# EAGLE design sim7000 gps (EAGLE 9.5.2)
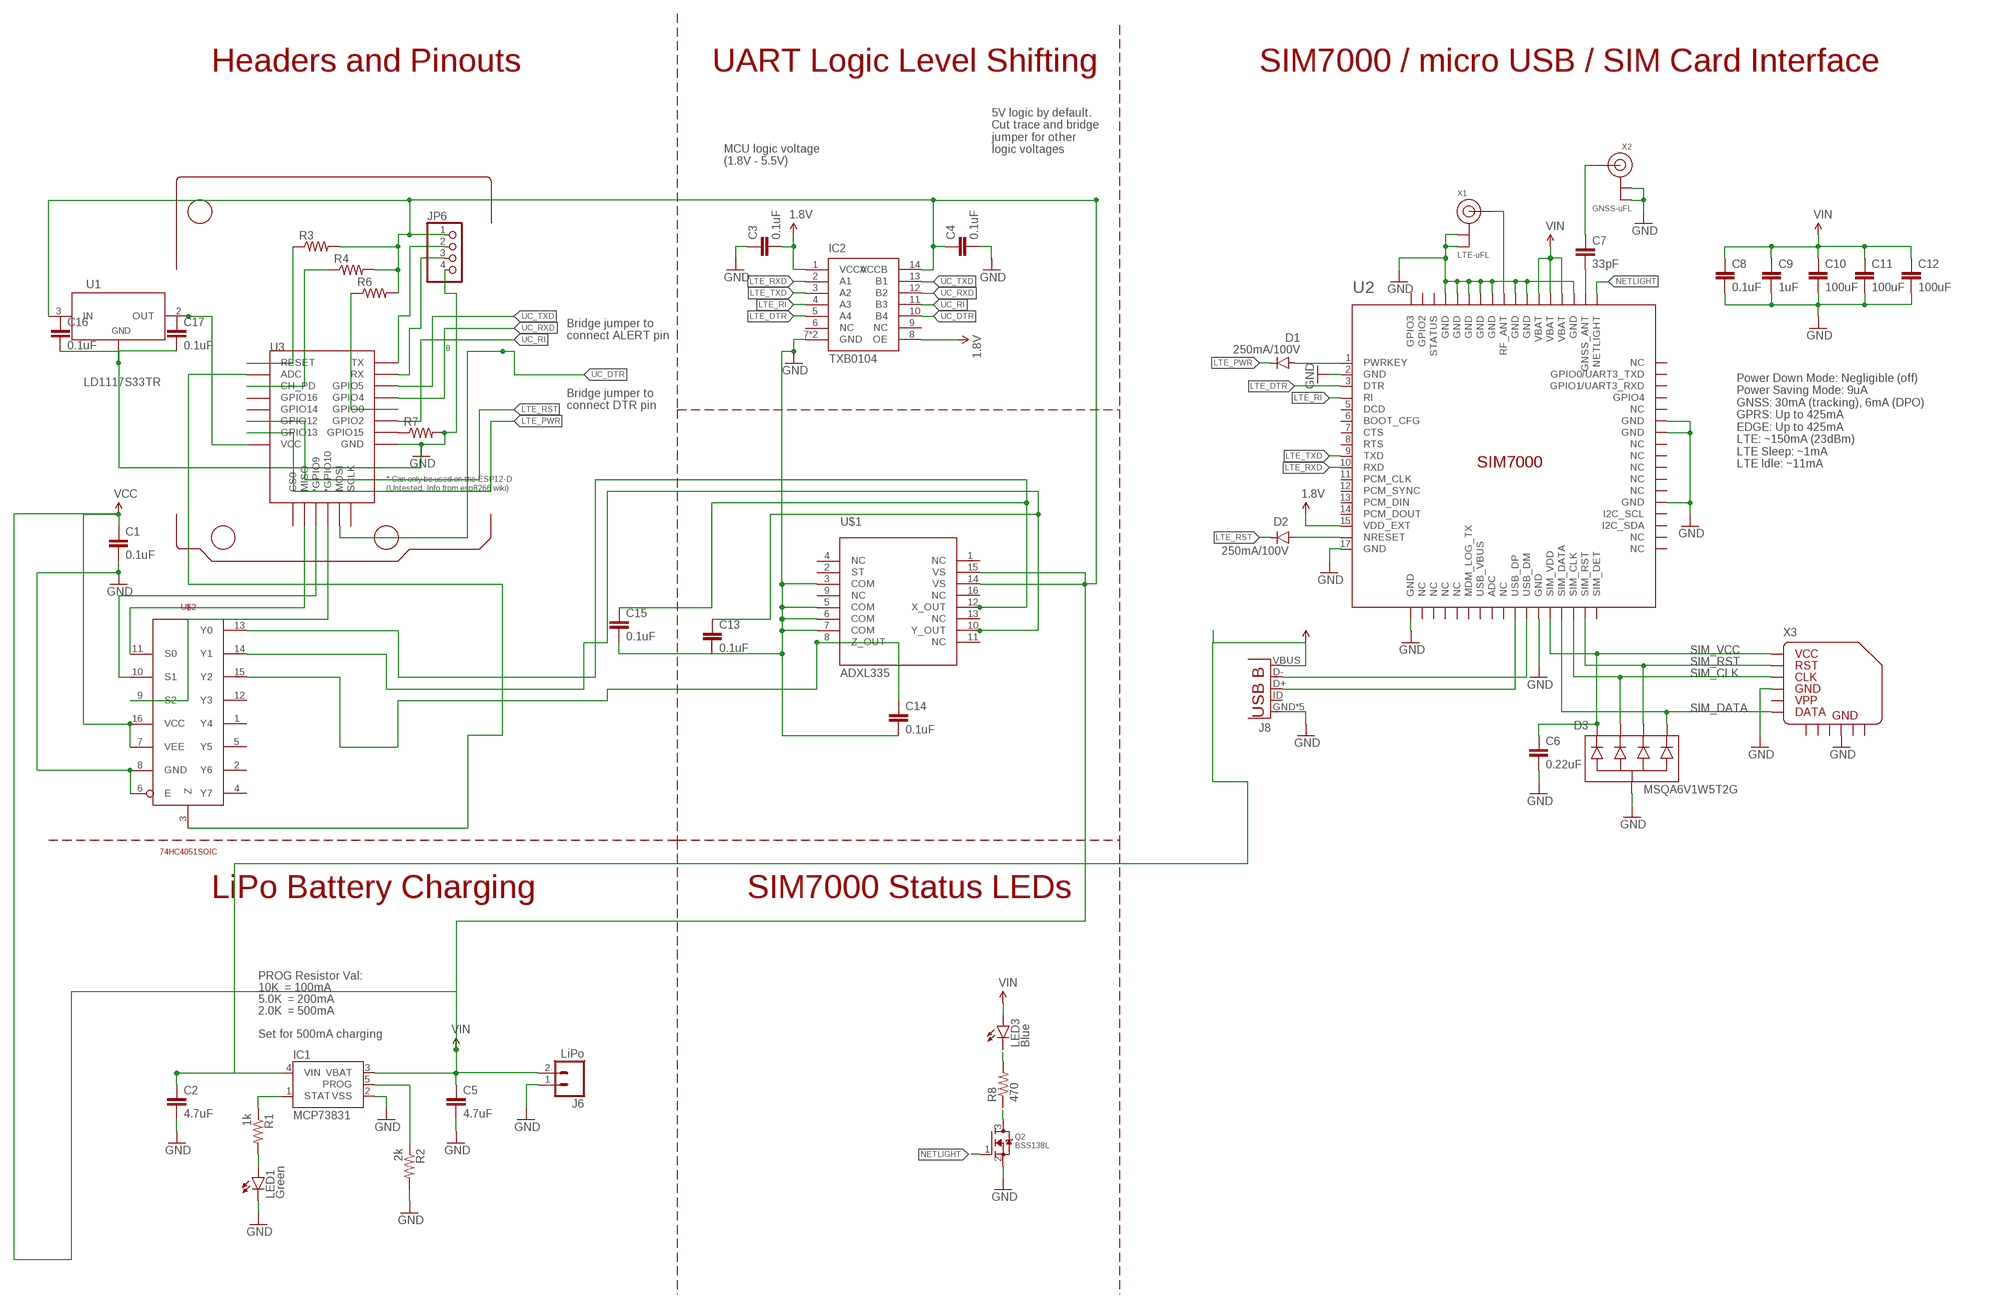
[diagram p0: schematic, sheet 1]

## Parts
C1  0.1uF  0.1UF-0603-25V-(+80/-20%)  [0603]
C2  4.7uF  CAPMARKED-0603  [0603-CAP-MARKED]
C3  0.1uF  CAPMARKED-0603  [0603-CAP-MARKED]
C4  0.1uF  CAPMARKED-0603  [0603-CAP-MARKED]
C5  4.7uF  CAPMARKED-0603  [0603-CAP-MARKED]
C6  0.22uF  CAPMARKED-0603  [0603-CAP-MARKED]
C7  33pF  CAPMARKED-0603  [0603-CAP-MARKED]
C8  0.1uF  CAPMARKED-0603  [0603-CAP-MARKED]
C9  1uF  CAPMARKED-0603  [0603-CAP-MARKED]
C10  100uF  CAPMARKED-1210  [1210]
C11  100uF  CAPMARKED-1210  [1210]
C12  100uF  CAPMARKED-1210  [1210]
C13  0.1uF  CAPMARKED-0603  [0603-CAP-MARKED]
C14  0.1uF  CAPMARKED-0603  [0603-CAP-MARKED]
C15  0.1uF  CAPMARKED-0603  [0603-CAP-MARKED]
C16  0.1uF  0.1UF-0603-25V-(+80/-20%)  [0603]
C17  0.1uF  0.1UF-0603-25V-(+80/-20%)  [0603]
D1  250mA/100V  DIODESOD323  [SOD-323]
D2  250mA/100V  DIODESOD323  [SOD-323]
D3  MSQA6V1W5T2G  TVS-DIODE-ARRAY-4X  [SOT-353]
IC1  MCP73831  [SOT23-5]
IC2  TXB0104  LEVEL_SHIFTER_TXB0104TXB0104RGYR  [VQFN-14]
J6  LiPo  M02-JST-2MM-SMT  [JST-2-SMD]
J8  microUSB  MICRO-USB_SMD_NOSHIELDV1  [USB-B-MICRO-SMD]
JP6  PINHD-1X4  [1X04]
LED1  Green  LED0603-MARKED  [LED-0603-MARKED]
LED3  Blue  LED0603-MARKED  [LED-0603-MARKED]
Q2  BSS138L  MOSFET-NGENERIC  [SOT23-3]
R1  1k  RESISTORMARKED-0603  [0603-RES-MARKED]
R2  2k  RESISTORMARKED-0603  [0603-RES-MARKED]
R3  R-US_R0603  [R0603]
R4  R-US_R0603  [R0603]
R6  R-US_R0603  [R0603]
R7  R-US_R0603  [R0603]
R8  470  RESISTORMARKED-0603  [0603-RES-MARKED]
U1  LD1117S33TR  [SOT-223]
U2  SIM7000  [SIM7000]
U3  ESP12ESMD  [ESP12E-SMD]
U$1  ADXL335  [LFCSP16]
U$2  74HC4051SOIC  [SOIC-16_3.9MM]
X1  LTE-uFL  ANTENNA_U.FL  [U.FL]
X2  GNSS-uFL  ANTENNA_U.FL  [U.FL]
X3  MICROSIM_SOCKET_PUSH-PULL  [MICROSIM_SOCKET_PUSH-PULL]

## Nets
1.8V: C3.2 IC2.1(VCCA) IC2.8(OE) U2.15(VDD_EXT)
GND: C1.2 C2.2 C3.1 C4.2 C5.2 C6.2 C8.2 C9.2 C10.2 C11.2 C12.2 C13.2 C14.2 C15.2 C16.2 C17.2 D3.2(COM) IC1.2(VSS) IC2.7(GND) IC2.PAD(GND) J6.1 J8.GND J8.SHIELD1(GND) J8.SHIELD2(GND) J8.SHIELD3(GND) J8.SHIELD4(GND) JP6.4 LED1.C Q2.2(S) R2.2 R7.2 U1.1(ADJ/GND) U2.2(GND) U2.17(GND) U2.18(GND) U2.29(GND) U2.39(GND) U2.45(GND) U2.46(GND) U2.54(GND) U2.58(GND) U2.59(GND) U2.61(GND) U2.62(GND) U2.63(GND) U2.64(GND) U2.65(GND) U3.GND U$1.3(COM) U$1.5(COM) U$1.6(COM) U$1.7(COM) U$2.6(E) U$2.8(GND) X1.1(GND) X1.2(GND) X2.1(GND) X2.2(GND) X3.C5 X3.GND@4(GND)
LTE_DTR: IC2.5(A4) U2.3(DTR)
LTE_PWR: D1.C U3.GPIO13
LTE_RI: IC2.4(A3) U2.4(RI)
LTE_RST: D2.C U3.GPIO12
LTE_RXD: IC2.2(A1) U2.10(RXD)
LTE_TXD: IC2.3(A2) U2.9(TXD)
N$1: C7.2 U2.53(GNSS_ANT)
N$2: D1.A U2.1(PWRKEY)
N$3: C7.1 X2.3(SIGNAL)
N$4: U3.MISO U$2.11(S0)
N$5: U3.GPIO9(*GPIO9) U$2.10(S1)
N$6: R7.1 U3.GPIO15
N$8: J8.D- U2.28(USB_DM)
N$9: J8.D+ U2.27(USB_DP)
N$10: Q2.3(D) R8.1
N$11: LED3.C R8.2
N$12: U3.GPIO10(*GPIO10) U$2.9(S2)
N$13: R3.1 U3.RESET
N$14: LED1.A R1.2
N$15: R4.1 U3.CH_PD
N$16: C14.1 U$1.8(Z_OUT) U$2.15(Y2)
N$17: U1.2(OUT) U1.4 U3.VCC
N$18: R6.1 U3.GPIO0
N$20: C13.1 U$1.10(Y_OUT) U$2.14(Y1)
N$21: C15.1 U$1.12(X_OUT) U$2.13(Y0)
N$23: JP6.2 U3.TXD0(TX)
N$24: JP6.3 U3.RXD0(RX)
N$26: U3.ADC U$2.3(Z)
NETLIGHT: Q2.1(G) U2.52(NETLIGHT)
NRESET: D2.A U2.16(NRESET)
PROG: IC1.5(PROG) R2.1
RF_ANT: U2.60(RF_ANT) X1.3(SIGNAL)
SIM_CLK: D3.3 U2.32(SIM_CLK) X3.C3
SIM_DATA: D3.5 U2.31(SIM_DATA) X3.C7
SIM_RST: D3.4 U2.33(SIM_RST) X3.C2
SIM_VCC: C6.1 D3.1 U2.30(SIM_VDD) X3.C1
STAT: IC1.1(STAT) R1.1
UC_DTR: IC2.10(B4) U3.MOSI
UC_RI: IC2.11(B3) U3.GPIO2
UC_RXD: IC2.12(B2) U3.GPIO4
UC_TXD: IC2.13(B1) U3.GPIO5
V_USB: C2.1 IC1.4(VIN) J8.VBUS
VIN: C1.1 C4.1 C5.1 C8.1 C9.1 C10.1 C11.1 C12.1 IC1.3(VBAT) IC2.14(VCCB) J6.2 JP6.1 LED3.A R3.2 R4.2 R6.2 U1.3(IN) U2.55(VBAT) U2.56(VBAT) U2.57(VBAT) U$1.14(VS) U$1.15(VS) U$2.7(VEE) U$2.16(VCC) ; supply symbol labelled VCC
Unconnected: C16.1 C17.1 IC2.6(NC) IC2.9(NC) J8.ID(USBID) U2.5(DCD) U2.6(BOOT_CFG) U2.7(CTS) U2.8(RTS) U2.11(PCM_CLK) U2.12(PCM_SYNC) U2.13(PCM_DIN) U2.14(PCM_DOUT) U2.19(NC) U2.20(NC) U2.21(NC) U2.22(NC) U2.23(MDM_LOG_TX) U2.24(USB_VBUS) U2.25(ADC) U2.26(NC) U2.34(SIM_DET) U2.35(NC) U2.36(NC) U2.37(I2C_SDA) U2.38(I2C_SCL) U2.40(NC) U2.41(NC) U2.42(NC) U2.43(NC) U2.44(NC) U2.47(NC) U2.48(GPIO4) U2.49(GPIO1/UART3_RXD) U2.50(GPIO0/UART3_TXD) U2.51(NC) U2.66(STATUS) U2.67(GPIO2) U2.68(GPIO3) U3.CS0 U3.GPIO14 U3.GPIO16 U3.SCLK U$1.1(NC) U$1.2(ST) U$1.4(NC) U$1.9(NC) U$1.11(NC) U$1.13(NC) U$1.16(NC) U$2.1(Y4) U$2.2(Y6) U$2.4(Y7) U$2.5(Y5) U$2.12(Y3) X3.C6

## Notes on the sheet
- Headers and Pinouts | UART Logic Level Shifting | SIM7000 / micro USB / SIM Card Interface
- 5V logic by default.
  Cut trace and bridge
  jumper for other
  logic voltages
- MCU logic voltage
  (1.8V - 5.5V)
- Bridge jumper to
  connect ALERT pin
- 8
- Bridge jumper to
  connect DTR pin
- Power Down Mode: Negligible (off)
  Power Saving Mode: 9uA
  GNSS: 30mA (tracking), 6mA (DPO)
  GPRS: Up to 425mA
  EDGE: Up to 425mA
  LTE: ~150mA (23dBm)
  LTE Sleep: ~1mA
  LTE Idle: ~11mA
- LiPo Battery Charging | SIM7000 Status LEDs
- PROG Resistor Val:
- 10K  = 100mA
- 5.0K  = 200mA
- 2.0K  = 500mA
- Set for 500mA charging

## Power pins joined to a net without a drawn wire
GND: X3.GND@1(GND) X3.GND@2(GND) X3.GND@3(GND) X3.GND@5(GND) X3.GND@6(GND)

## Library data of the parts
C1 C16 C17 = SparkFun-Capacitors:0.1UF: 0.1µF ceramic capacitors A capacitor is a passive two-terminal electrical component used to store electrical energy temporarily in an electric field.; PROD_ID: CAP-00810
C2-C15 = TimWoo-Capacitors:CAP: Capacitor Standard 0603 ceramic capacitor, and 0.1" leaded capacitor.
D1 D2 = TimWoo-Diodes:DIODE: Diode These are standard reverse protection diodes and small signal diodes. SMA package can handle up to about 1A. SOD-323 can handle about 200mA. What the SOD-323 package when ordering, there are some mfgs out there that are 5-pin packages.; PROD_ID: DIO-09646
D3 = TimWoo-Diodes:TVS-DIODE-ARRAY-4X
IC1 = TimWoo-IC:MCP73831: Miniature single cell, fully integrated Li-Ion, Li-polymer charge management controller http://ww1.microchip.com/downloads/en/DeviceDoc/20001984g.pdf IC-09995; PROD_ID: IC-09995
IC2 = TimWoo-IC:LEVEL_SHIFTER_TXB0104
J6 = TimWoo-Connectors:M02: Standard 2-pin 0.1" header. Use with - straight break away headers ( PRT-00116) - right angle break away headers (PRT-00553) - swiss pins (PRT-00743) - machine pins (PRT-00117) - female headers (PRT-00115) Molex polarized connector foot print use with: PRT-08233 with associated crimp pins and housings. 2.54_SCREWTERM for use with PRT-10571. 3.5mm Screw Terminal footprints for PRT-08084 5mm Screw Terminal footprints for use with PRT-08432; PROD_ID: CONN-11443
J8 = TimWoo-Connectors:MICRO-USB_SMD_NOSHIELD
JP6 = pinhead:PINHD-1X4: PIN HEADER
LED1 LED3 = TimWoo-LED:LED: LEDs Standard schematic elements and footprints for 5mm, 3mm, 1206, and 0603 sized LEDs. 5mm - Spark Fun Electronics SKU : COM-00529 (and others)
Q2 = TimWoo-MOSFETs:MOSFET-N: N-Channel Mosfet DMG2302UK - 20V 2.8A SOT23 [Digikey: DMG2302UK-7DICT-ND] 2N7002E - 60V 260mA SOT23 [Digikey: 2N7002ET1GOSTR-ND] - REEL BSH103 - 30V 850mA SOT23 [Digikey: 568-5013-1-ND]
R1 R2 R8 = TimWoo-Resistors:RESISTOR: Resistor Basic schematic elements and footprints for 0603, 1206, and PTH resistors.
R3 R4 R6 R7 = resistor:R-US_: RESISTOR, American symbol
U1 = IC:LD1117S33TR: IC REG LINEAR 3.3V 800MA SOT223 Manufacturer's datasheet <http://www.st.com/content/ccc/resource/technical/document/datasheet/99/3b/7d/91/91/51/4b/be/CD00000544.pdf/files/CD00000544.pdf/jcr:content/translations/en.CD00000544.pdf>; CREATED_BY: PCBLayout.com; DIGIKEY_PART_NUMBER: 497-1242-2-ND; MANUFACTURER: STMicroelectronics; MPN: LD1117S33TR; PACKAGE: SOT-223
U2 = TimWoo-RF:SIM7000
U3 = esp8266modules:ESP12E: ESP12E Module
U$1 = adxl335:ADXL335: ADXL335 Package: LFCSP16 Descripton: small, low power, 3-Axis ±3g Accelerometer Author: Braekevelt Wim Student @ KHBO Ostend Mail : braekevelt.wim@telenet.be <mailto:braekevelt.wim@telenet.be?subject=ADXL335 remark>; IC: ADXL335
U$2 = 74HC4051:74HC4051; AVAILABILITY: Unavailable; DESCRIPTION: 1 Circuit IC Switch 8:1 120Ohm 16-SO; MF: MICROSS/On Semiconductor; MP: 74HC4051; PACKAGE: Die Micross; PRICE: None
X1 X2 = TimWoo-Connectors:ANTENNA_U.FL: U.FL Antenna Connector
X3 = TimWoo-Connectors:MICROSIM_SOCKET_PUSH-PULL: https://www.digikey.com/product-detail/en/molex-llc/0786463001/WM9364CT-ND/3770350

## Net classes
0 default: width 0.305 mm

## Board
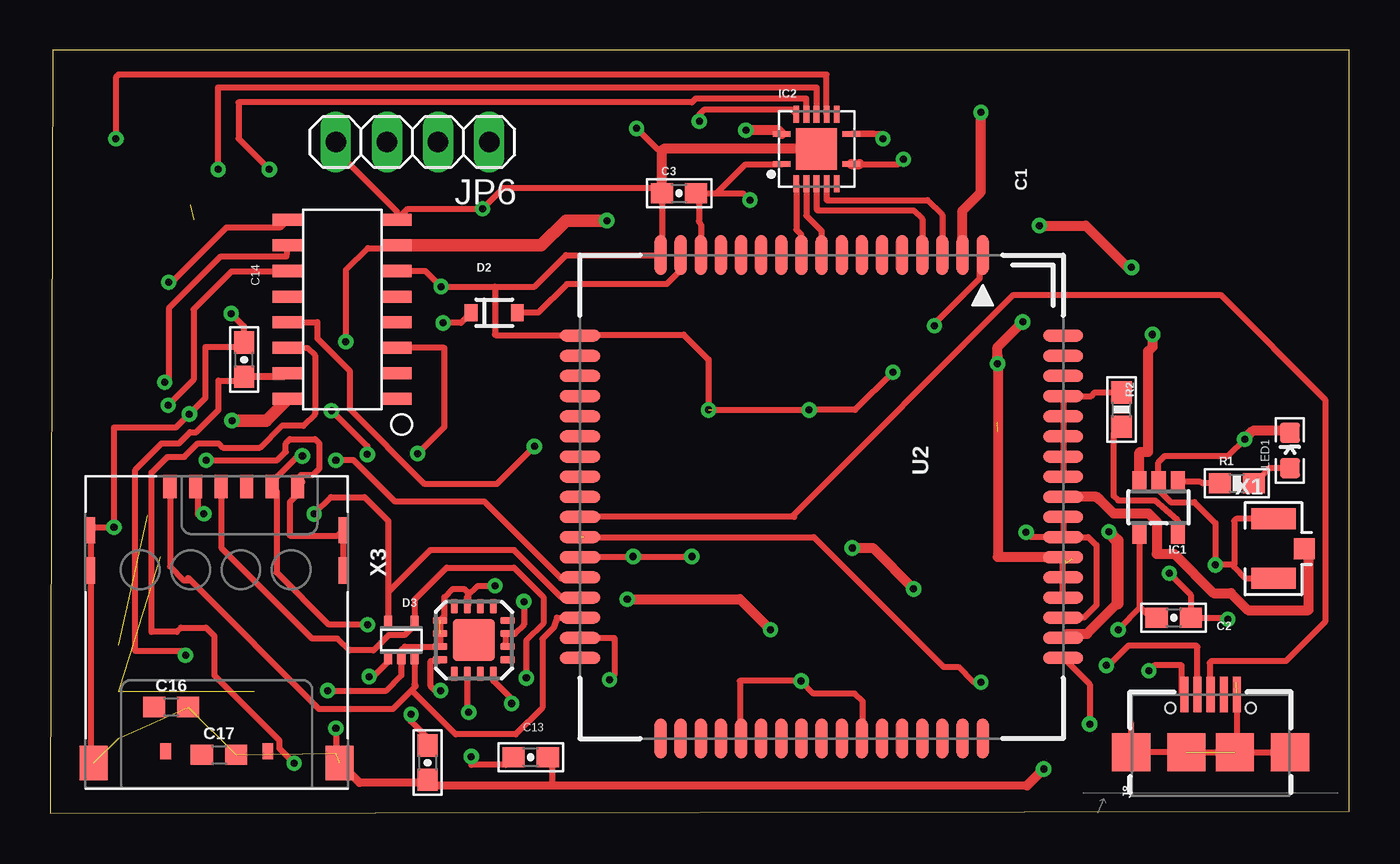
[diagram p1: board, top side]
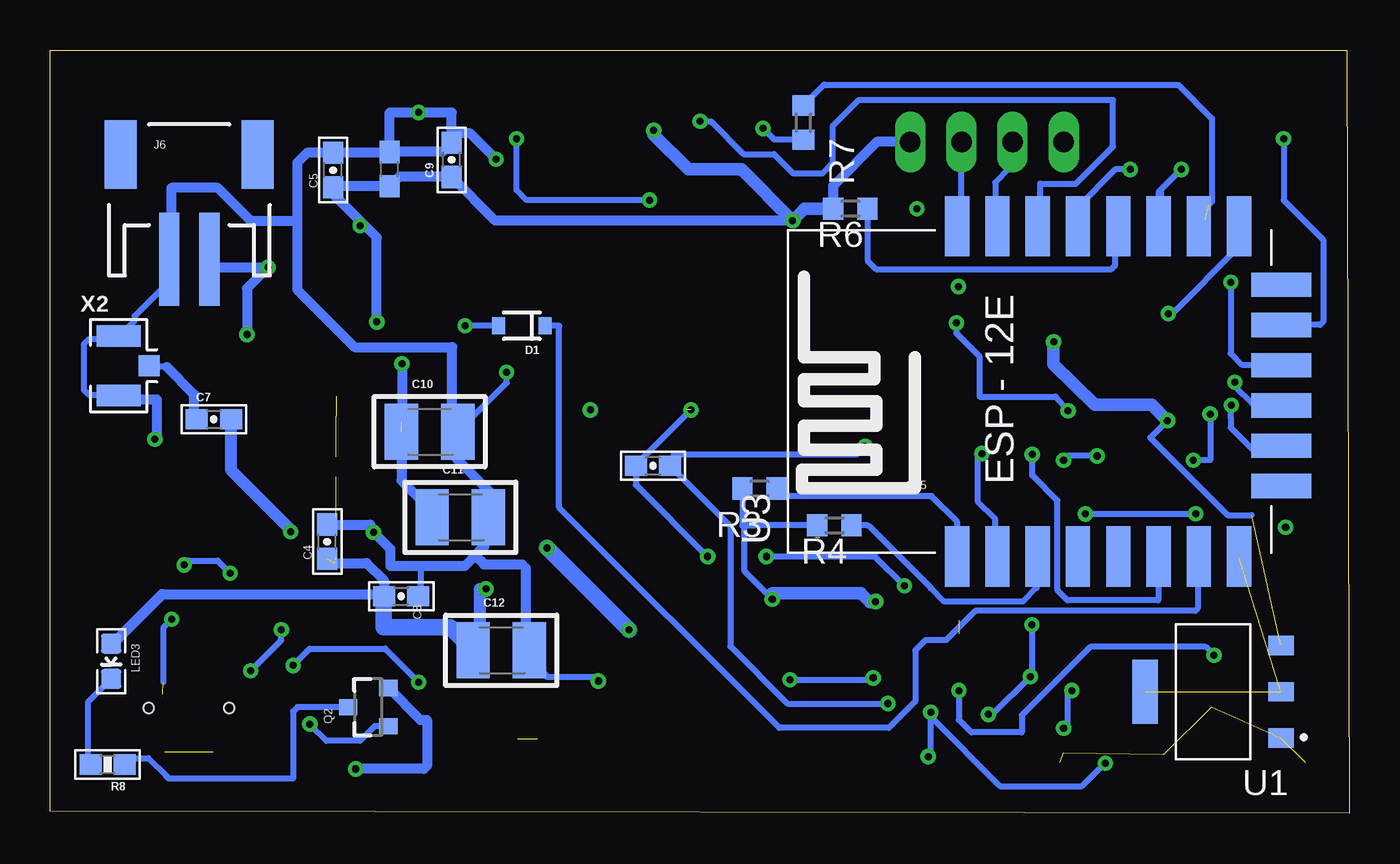
[diagram p2: board, bottom side, seen from below]

Size 64.51 x 37.89 mm. Coordinates in mm from the lower left corner, seen from the top.
Outline: 0,0 64.51,0.11 64.51,37.89 0.11,37.89 0,0
Copper layers (1*16): Top 0.035mm / dielectric 1.5mm / Bottom 0.035mm
Design rules "default *": minimum track width 6mil, minimum drill 0.35mm, track to track 6mil, track to pad 6mil, pad to pad 6mil, via to via 6mil, smd to smd 6mil, copper to edge 40mil, drill to drill 8mil, minimum pad ring 10mil, minimum via ring 8mil, stop-mask expansion 4mil, vias tented up to drill 0mil, thermal gap 10mil

### Footprints (pad centres in the part's own frame; a part is rotated, then mirrored left to right if it is on the bottom)
0603 = smd 1.1 x 1: 1 -0.85,0; 2 0.85,0
0603-CAP-MARKED = smd 1.1 x 1: 1 -0.85,0; 2 0.85,0
1210 = smd 1.651 x 2.794: 1 -1.397,0; 2 1.397,0
SOD-323 = smd 0.63 x 0.83: A 1.15,0; C -1.15,0
SOT-353 = smd 0.4 x 0.5: 1 -0.65,-0.95; 2 0,-0.95; 3 0.65,-0.95; 4 0.65,0.95; 5 -0.65,0.95
SOT23-5 = smd 0.7 x 1: 1 -0.95,-1.3; 2 0,-1.3; 3 0.95,-1.3; 4 0.95,1.3; 5 -0.95,1.3
VQFN-14 = smd 0.85 x 0.28: 1 -1.725,-0.75; 7 1.725,-0.75; 8 1.725,0.75; 14 -1.725,0.75 | smd 0.28 x 0.85: 2 -1,-1.725; 3 -0.5,-1.725; 4 0,-1.725; 5 0.5,-1.725; 6 1,-1.725; 9 1,1.725; 10 0.5,1.725; 11 0,1.725; 12 -0.5,1.725; 13 -1,1.725 | smd 2.05 x 2.05: PAD 0,0
JST-2-SMD = smd 1 x 4.6: 1 -1,-3.7; 2 1,-3.7 | smd 1.6 x 3.4: NC1 -3.4,1.5; NC2 3.4,1.5
USB-B-MICRO-SMD = smd 1.75 x 0.4: D+ 2.875,0; D- 2.875,0.65; GND 2.875,-1.3; ID 2.875,-0.65; VBUS 2.875,1.3 | smd 1.9 x 1.9: SHIELD1 0,3.95; SHIELD2 0,-3.95; SHIELD3 0,1.2; SHIELD4 0,-1.2 | hole 0.5: 2.2,2; 2.2,-2
1X04 = drill 1.016 long: 1 -3.81,0; 2 -1.27,0; 3 1.27,0; 4 3.81,0
LED-0603-MARKED = smd 1 x 1: A -0.877,0; C 0.877,0
SOT23-3 = smd 0.8 x 0.9: 1 -0.95,-1; 2 0.95,-1; 3 0,1
0603-RES-MARKED = smd 1.1 x 1: 1 -0.85,0; 2 0.85,0
R0603 = smd 1 x 1.1: 1 -0.85,0; 2 0.85,0
SOT-223 = smd 1.26 x 0.96: 1 -3.375,2.3; 2 -3.375,0; 3 -3.375,-2.3 | smd 1.26 x 3.19: 4 3.375,0
SIM7000 = smd 2 x 0.6: 1 -12,8; 2 -12,7; 3 -12,6; 4 -12,5; 5 -12,4; 6 -12,3; 7 -12,2; 8 -12,1; 9 -12,0; 10 -12,-1; 11 -12,-2; 12 -12,-3; 13 -12,-4; 14 -12,-5; 15 -12,-6; 16 -12,-7; 17 -12,-8; 35 12,-8; 36 12,-7; 37 12,-6; 38 12,-5; 39 12,-4; 40 12,-3; 41 12,-2; 42 12,-1; 43 12,0; 44 12,1; 45 12,2; 46 12,3; 47 12,4; 48 12,5; 49 12,6; 50 12,7; 51 12,8 | smd 0.6 x 2: 18 -8,-12; 19 -7,-12; 20 -6,-12; 21 -5,-12; 22 -4,-12; 23 -3,-12; 24 -2,-12; 25 -1,-12; 26 0,-12; 27 1,-12; 28 2,-12; 29 3,-12; 30 4,-12; 31 5,-12; 32 6,-12; 33 7,-12; 34 8,-12; 52 8,12; 53 7,12; 54 6,12; 55 5,12; 56 4,12; 57 3,12; 58 2,12; 59 1,12; 60 0,12; 61 -1,12; 62 -2,12; 63 -3,12; 64 -4,12; 65 -5,12; 66 -6,12; 67 -7,12; 68 -8,12
ESP12E-SMD = smd 3 x 1.2: ADC -8.3,3.8; CH_PD -8.3,1.8; GND 8.1,-8.2; GPIO0 8.1,-2.2; GPIO2 8.1,-4.2; GPIO4 8.1,-0.2; GPIO5 8.1,1.8; GPIO12 -8.3,-4.2; GPIO13 -8.3,-6.2; GPIO14 -8.3,-2.2; GPIO15 8.1,-6.2; GPIO16 -8.3,-0.2; RESET -8.3,5.8; RXD0 8.1,3.8; TXD0 8.1,5.8; VCC -8.3,-8.2 | smd 1.2 x 3: CS0 -4.8,-10.3; GPIO9 -0.8,-10.3; GPIO10 1.2,-10.3; MISO -2.8,-10.3; MOSI 3.2,-10.3; SCLK 5.2,-10.3
LFCSP16 = smd 0.7 x 0.35: 1 -1.675,0.975; 2 -1.675,0.325; 3 -1.675,-0.325; 4 -1.675,-0.975; 9 1.675,-0.975; 10 1.675,-0.325; 11 1.675,0.325; 12 1.675,0.975 | smd 0.35 x 0.7: 5 -0.975,-1.675; 6 -0.325,-1.675; 7 0.325,-1.675; 8 0.975,-1.675; 13 0.975,1.675; 14 0.325,1.675; 15 -0.325,1.675; 16 -0.975,1.675 | smd 2.1 x 2.1: EXP 0,0
SOIC-16_3.9MM = smd 0.6 x 1.5: 1 -4.445,-2.7; 2 -3.175,-2.7; 3 -1.905,-2.7; 4 -0.635,-2.7; 5 0.635,-2.7; 6 1.905,-2.7; 7 3.175,-2.7; 8 4.445,-2.7; 9 4.445,2.7; 10 3.175,2.7; 11 1.905,2.7; 12 0.635,2.7; 13 -0.635,2.7; 14 -1.905,2.7; 15 -3.175,2.7; 16 -4.445,2.7
U.FL = smd 2.2 x 1.05: 1 0,1.475; 2 0,-1.475 | smd 1.05 x 1.05: 3 1.525,0
MICROSIM_SOCKET_PUSH-PULL = smd 1.15 x 0.65: C1 -6.865,2.755; C2 -6.865,0.215; C3 -6.865,-2.325; C5 -6.865,4.025; C6 -6.865,1.485; C7 -6.865,-1.055 | smd 1.3 x 0.45: GND@1 -4.695,6.27; GND@2 -2.695,6.27; GND@3 -4.695,-6.27; GND@4 -2.695,-6.27 | smd 1.7 x 1.4: GND@5 6.865,6.105; GND@6 6.865,-6.105 | smd 0.8 x 0.54: X1 6.285,2.54; X2 6.285,-2.54

### Placement (x,y rotation side)
C1  47.66,31.99 90 bottom
C2  55.8,9.72 0 top
C3  31.23,30.79 0 top
C4  50.76,13.49 90 bottom
C5  50.47,31.95 90 bottom
C6  18.73,2.52 270 top
C7  56.39,19.57 0 bottom
C8  47.09,10.78 0 bottom
C9  44.58,32.45 90 bottom
C10  45.67,18.95 0 bottom
C11  44.15,14.71 0 bottom
C12  42.12,8.1 0 bottom
C13  23.86,2.8 0 top
C14  9.63,22.53 90 top
C15  34.58,17.26 180 bottom
C16  6,5.29 0 top
C17  8.38,2.91 0 top
D1  41.09,24.22 180 bottom
D2  22.05,24.87 0 top
D3  17.43,8.61 0 top
IC1  55.05,15.2 180 top
IC2  38.05,32.99 0 top
J6  57.61,31.22 0 bottom
J8  57.63,3.04 90 top
JP6  17.99,33.34 180 top
LED1  61.57,18.03 90 top
LED3  61.49,7.56 270 bottom
Q2  48.72,5.28 90 bottom
R1  58.93,16.39 0 top
R2  53.21,20.05 90 top
R3  29.29,16.14 180 bottom
R4  25.57,14.31 180 bottom
R6  24.78,30.03 180 bottom
R7  27.11,34.3 270 bottom
R8  61.66,2.43 180 bottom
U1  6.76,6.04 180 bottom
U2  38.31,15.72 270 top
U3  13.67,21.06 90 bottom
U$1  21.04,8.61 270 top
U$2  14.5,25.03 90 top
X1  60.75,13.15 0 top
X2  61.12,22.23 0 bottom
X3  8.27,9.37 270 top

### Tracks (layer width: path | path; a pad name or v marks a point on that pad's centre or on a via)
1.8V  (via drill 0.35)
  Top 0.305: IC2.1 36.33,32.23 34.54,32.23 33.09,30.79 C3.2 | 32.59,30.79 C3.2 | 40.94,33.74 IC2.8 41.3,33.74 41.36,33.69 v41.36,33.5 | U2.15 32.31,29.25 32.21,29.41 32.21,30.58 C3.2 | 34.72,30.45 v34.75,30.45 34.42,30.79 C3.2
  Bottom 0.305: v34.75,30.45 40.85,30.45 41.36,30.96 v41.36,33.5
GND  (via drill 0.35)  (14 unrouted)
  Top 0.305: U$2.6 18.64,26.93 v19.41,26.16 22.09,26.16 | U2.58 48.71,13.72 v48.46,13.97 | IC2.7 42.13,32.24 v42.37,32.49 | U2.39 34.24,3.79 34.24,6.58 v37.29,6.58 37.92,5.95 39.95,5.95 40.34,5.56 40.34,3.75 U2.45 | C6.2 18.58,1.52 | C13.2 24.92,2.59 24.92,1.38 | JP6.4 14.18,32.92 17.2,29.9 U$2.8 17.75,30.02 v21.46,30.02 22.5,31.06 30.38,31.06 | U2.59 U2.58 | U2.58 51.56,13.72 51.95,13.33 51.96,13.33 51.96,10.34 | R2.2 51.88,20.9 51.69,20.72 U2.65 U2.61 | v58.49,9.64 58.49,9.72 C2.2 56.65,10.86 v55.58,11.93 | J8.GND 58.93,3.14 J8.SHIELD4 | J8.SHIELD2 J8.SHIELD3 J8.SHIELD1 53.68,4.46 | U2.54 50.22,9.64 | v59.32,18.58 58.49,17.75 55.37,17.75 55.05,17.43 IC1.2 55.13,16.41 55.13,15.98 55.65,15.46 56.82,15.46 57.86,14.42 v57.86,12.34 58.8,12.34 | 22.09,26.16 24.05,26.16 25.61,27.72 30.2,27.72 | 30.2,27.72 U2.17 | C3.1 30.38,27.9 30.2,27.72 | 22.09,26.16 22.09,23.78 22.15,23.72 U2.18 26.36,23.77 31.46,23.77 32.7,22.53 v32.7,20.04 | v8.98,24.82 9.61,24.2 9.61,23.41 C14.2 9.4,23.16 7.7,23.16 7.7,20.62 v6.9,19.83 6.24,19.16 3.16,19.16 v3.16,14.21 2.14,14.21 X3.GND@3 X3.GND@4 2,2.67 X3.GND@6 | v31.86,12.76 v28.95,12.76 28.84,12.76 28.81,12.72 U2.29 | v41.85,21.91 39.98,20.04 v37.69,20.04 32.9,20.04 | v13.77,6.1 16.68,6.1 17.43,6.86 D3.2 17.43,8.1 17.62,8.28 U$1.7 U$1.5 19.58,9.81 19.58,10.74 19.99,11.15 20.55,11.15 20.75,10.95 20.75,10.32 U$1.3 20.71,10.78 21.23,11.3 v22.09,11.3 | v14.18,4.23 14.18,2.98 | 12.52,16.47 12.43,16.38 | 12.43,16.38 X3.C5 12.29,15.86 11.9,15.46 11.9,13.8 14.27,13.8 X3.GND@1 X3.GND@2 | 12.43,16.38 12.43,16.8 13.02,16.8 13.35,17.13 13.35,18.37 13.14,18.58 11.9,18.58 11.69,18.37 11.69,17.96 11.27,17.54 v7.74,17.54
  Top 0.305: X1.2 59.36,11.68 58.8,12.24 58.8,12.34 | 60.75,14.77 X1.1 58.91,14.63 58.9,14.63 58.8,14.53 58.8,12.34 | v29.12,34.01 30.14,32.99 30.47,32.99
  Top 0.31: 51.96,10.34 51.35,9.72 U2.54
  Top 0.405: X3.GND@5 15.36,1.52 18.58,1.52 | C6.2 19.03,1.38 24.92,1.38 48.51,1.38
  Top 0.505: v49.34,2.21 48.51,1.38
  Top 0.508: U2.2 45.31,29.94 46.22,30.85 v46.22,34.81 | IC2.7 40.19,32.24 | IC2.PAD 30.47,32.99 30.38,32.91 30.38,31.06 C3.1 | LED1.C 61.55,18.9 61.45,19 59.74,19 v59.32,18.58
  Bottom 0.305: 14.15,33.38 JP6.4 | 5.69,29.26 U3.GND 5.47,28.13 8.78,24.82 v8.98,24.82 | 42.96,13.26 42.96,14.63 C11.2 42.73,14.86 42.73,16 | 48.62,14.34 v48.46,13.97 | 41.06,12.36 40.9,12.2 | 40.9,8.13 C12.2 40.72,7.69 39.82,6.79 37.5,6.79 v37.29,6.58 | 44.33,17.6 44.33,18.83 C10.2 41.85,21.38 v41.85,21.91 | 44.73,33.07 44.67,33.16 C9.2 | X2.2 61.24,20.8 62.62,20.8 62.84,21.03 62.84,23.32 62.62,23.55 61.24,23.55 X2.1 61.08,23.7 60.33,24.46 60.33,24.69 58.73,26.29 58.73,27.43 J6.1 58.5,27.66 58.5,28.57 58.5,29.4 | v58.49,9.64 58.9,9.22 58.9,6.52 | v32.7,20.04 35.44,17.29 C15.2 35.43,16.32 v31.86,12.76 | v22.09,11.3 23.54,12.76 v28.95,12.76 | v13.77,6.1 13.98,5.89 13.98,4.23 v14.18,4.23 | v6.9,19.83 6.9,17.54 v7.74,17.54 | v55.58,11.93 56.2,12.55 57.66,12.55 v57.86,12.34 | 46.07,12.3 46.13,12.24 46.13,10.89 | R7.2 28.55,33.45 v29.12,34.01
  Bottom 0.505: 46.13,10.89 C8.2 | 47.63,12.3 46.07,12.3 43.92,12.3 43.41,12.8 | 42.96,13.26 43.41,12.8 | C4.2 48.62,14.34 | v48.46,13.97 47.63,13.13 | 40.9,12.2 40.9,8.13 | 41.06,12.36 42.98,12.36 43.41,12.8 | 42.73,16 44.33,17.6
  Bottom 0.508: C10.2 44.55,19.23 44.55,23.16 49.4,23.16 52.25,26.01 52.25,29.4 | v42.37,32.49 43.65,33.77 44.55,33.77 44.67,33.64 44.67,33.16 | C1.2 45.04,32.84 C9.2 44.58,34.81 v46.22,34.81 47.66,34.81 C1.2 | C1.2 47.7,32.8 C5.2 51.76,32.8 52.25,32.31 52.25,29.4 | 52.25,29.4 54.54,29.4 56.2,31.06 58.49,31.06 58.5,31.05 58.5,28.57 | X2.2 60.92,20.56 59.22,20.56 59.22,18.68 v59.32,18.58 | 47.63,13.13 47.63,12.3 | Q2.2 46.14,4.65 45.8,4.65 45.8,2.36 45.95,2.21 v49.34,2.21
LTE_DTR
  Top 0.305: IC2.5 38.55,30.45 43.57,30.45 44.31,29.72 U2.3
LTE_PWR
  Bottom 0.305: D1.C 39.25,24.22 39.23,24.21 39.23,15.18 28.3,4.25 22.86,4.25 21.54,5.56 21.54,8.1 21.04,8.61 20.02,8.61 18.57,10.06 7.65,10.06 7.52,10.19 7.52,12.57 U3.GPIO13
LTE_RI
  Top 0.305: IC2.4 38.05,30 38.11,29.95 42.88,29.95 43.31,29.52 U2.4
LTE_RST  (via drill 0.35)
  Top 0.305: v15.74,17.83 15.74,18.24 v13.96,20
  Top 0.31: D2.C 20.39,24.36 v19.51,24.36
  Bottom 0.305: v15.74,17.83 15.74,16.79 14.49,15.53 14.49,11.08 13.99,10.58 9.49,10.58 9.49,12.58 U3.GPIO12 | v13.96,20 14.59,20.7 18.36,20.7 18.36,22.7 19.51,23.85
  Bottom 0.31: v19.51,24.36 19.51,23.85
LTE_RXD
  Top 0.305: IC2.2 37.05,28.99 37.31,28.74 U2.10
LTE_TXD
  Top 0.305: IC2.3 37.55,29.68 38.31,28.93 U2.9
N$1  (via drill 0.35)
  Top 0.305: 50.5,8.92 U2.53
  Top 0.505: 53.01,10.43 51.49,8.92 50.5,8.92
  Top 0.605: v52.58,13.98 53.01,13.55 53.01,10.43
  Bottom 0.305: v52.58,13.98 52.58,14.09 | 55.53,19.37 C7.2
  Bottom 0.605: 55.53,19.37 55.53,17.04 52.58,14.09
N$2  (via drill 0.35)
  Top 0.305: v43.91,24.21 43.91,24.31 45.95,26.36 46.16,26.56 46.16,27.66 U2.1
  Bottom 0.305: D1.A 43.9,24.22 v43.91,24.21
N$3
  Bottom 0.305: 58.73,22.17 59.42,22.17 X2.3 | 57.36,19.6 C7.1
  Bottom 0.505: 58.73,22.17 57.36,20.8 57.36,19.6
N$4  (via drill 0.35)
  Top 0.305: v5.85,20.26 7.11,21.53 7.11,25.03 8.98,26.9 11.77,26.9 U$2.11
  Bottom 0.305: v5.85,20.26 5.88,19.64 5.88,19.16 4.78,18.06 3.41,18.06 U3.MISO
N$5  (via drill 0.35)
  Top 0.305: v5.67,21.41 5.88,21.61 5.88,25.08 8.46,27.66 11.73,27.66 U$2.10
  Bottom 0.305: v5.67,21.41 5.67,21.2 4.82,20.34 3.41,20.34 U3.GPIO9
N$6  (1 unrouted)
  Bottom 0.305: 7.15,29.48 U3.GPIO15 7.3,29.03 7.3,28.68 7.57,28.4 7.46,28.4 | R7.1 26.08,36.19 8.49,36.17 6.81,34.5 6.81,30.4 6.98,30.23
N$8  (via drill 0.35)  (1 unrouted)
  Top 0.305: 26.5,13.72 37.93,13.72 44.37,7.28 45.1,7.28 45.86,6.52 v46.22,6.52 | v52.46,7.35 52.56,7.35 53.55,8.33 56.9,8.33 56.98,8.25 J8.D-
  Bottom 0.305: v52.46,7.35 51.62,8.18 47.88,8.18 v46.22,6.52
N$9
  Top 0.305: J8.D+ 57.59,5.94 57.59,7.48 57.67,7.56 61.37,7.56 63.32,9.52 63.32,20.55 58.13,25.75 47.84,25.75 36.89,14.79 36.94,14.72 U2.27
N$10
  Bottom 0.305: R8.1 60.67,2.74 59.64,2.74 58.77,1.87 58.69,1.79 58.64,1.73 52.46,1.73 52.46,5.06 52.24,5.28 Q2.3
  Bottom 0.508: Q2.3 49.76,5.32
N$11
  Bottom 0.305: R8.2 62.65,2.57 | 62.65,2.57 62.72,2.64 | LED3.C 62.65,5.52 62.65,2.57
N$12  (via drill 0.35)
  Top 0.305: U$2.9 11.41,29.08 8.74,29.08 6.03,26.38 v5.88,26.38
  Bottom 0.305: v5.88,26.38 5.88,22.84 5.3,22.26 U3.GPIO10
N$13
  Bottom 0.305: U3.RESET 19.47,14.48 20.75,15.76 28.06,15.76 R3.1
N$14
  Top 0.305: LED1.A 60.53,17.15 R1.2
N$15
  Bottom 0.305: R4.1 23.93,14.31 23.86,14.28 20.78,11.2 20.78,11.18 20.12,10.52 16.21,10.52 15.52,11.2 15.52,12.57 U3.CH_PD
N$16  (via drill 0.35)
  Top 0.305: U$1.8 19.29,7.56 18.89,7.56 18.89,6.31 19.1,6.1 v19.38,6.1 | v6.71,7.85 6.5,8.06 4.22,8.06 4.22,17.06 5.53,18.37 6.39,18.37 6.95,18.93 7.25,18.93 8.36,20.04 8.36,21.49 9.44,21.49 C14.1 | C14.1 9.63,21.64 | 9.66,21.7 11.65,21.7 U$2.15 11.63,21.68 C14.1
  Bottom 0.305: v6.71,7.85 7.13,8.27 12.87,8.27 16.26,4.87 16.26,4.02 18.76,4.02 19.38,4.65 v19.38,6.1
N$17  (2 unrouted)
N$18
  Bottom 0.305: U3.GPIO0 11.64,29.03 11.64,27.2 11.82,27.03 23.5,27.03 23.93,27.45 R6.1
N$20  (via drill 0.35)
  Top 0.305: C13.1 22.62,2.41 20.91,2.41 v20.91,2.83 | 12.37,23.12 U$2.14 12.76,23.12 13.14,22.74 13.14,19.83 12.56,19.25 11.5,19.25 10.42,18.17 8.57,18.17 8.36,18.37 7.32,18.37 6.66,17.71 5.82,17.71 5.03,16.92 5.03,9.01 6.28,9.01 6.49,9.22 7.74,9.22 8.15,8.81 8.15,6.84 11.38,3.61 11.38,3.22 v12.11,2.49 11.93,2.67 | U$1.10 20.71,5.1 v20.78,5.03
  Bottom 0.305: v20.91,2.83 20.78,2.83 v20.78,5.03 20.78,4.8 17.34,1.36 13.27,1.36 12.14,2.49 v12.11,2.49
N$21  (via drill 0.35)
  Top 0.305: v22.91,5.46 23.11,5.49 22.01,6.58 U$1.12 | v24.04,18.23 22.17,16.35 18.6,16.35 14.88,20.08 14.88,21.97 13.26,23.59 13.26,24.39 U$2.13
  Bottom 0.305: C15.1 33.76,17.24 | v22.91,5.46 27.89,5.46 30.73,8.3 30.73,14.27 C15.1 | C15.1 33.62,17.15 | 24.16,18.34 v24.04,18.23 24.46,17.81 33.54,17.81 33.54,17.44 C15.1
N$23
  Bottom 0.305: 19.41,29.09 19.43,29.07 19.43,29.16 U3.TXD0 19.26,29.37 JP6.2
N$24
  Bottom 0.305: U3.RXD0 17.58,29.26 17.58,31.32 16.9,32 16.9,33.15 JP6.3
N$26  (via drill 0.35)
  Top 0.305: U$2.3 19.56,23.12 19.56,19.19 v18.25,17.87
  Bottom 0.305: v18.25,17.87 18.45,17.66 18.45,15.5 17.58,14.63 17.58,12.8 U3.ADC
NETLIGHT  (via drill 0.35)
  Top 0.305: 50.5,7.54 U2.52 51.62,6.41 v51.62,4.44
  Bottom 0.305: Q2.1 48.4,4.33 49.13,3.61 50.79,3.61 v51.62,4.44
NRESET
  Top 0.305: D2.A 24.24,24.87 25.66,26.29 30.61,26.29 31.3,26.97 31.3,27.66 U2.16
PROG
  Top 0.305: IC1.5 56,14.56 54.86,15.54 53.03,15.54 52.81,15.77 52.81,18.86 R2.1
RF_ANT
  Top 0.305: X1.3 62.48,12.94
  Top 0.505: 62.48,12.94 62.48,10.1 59.48,10.1 58.64,10.95 57.78,10.95 55.82,12.89 54.95,12.89 54.95,14.49 54.55,14.9 52.8,14.9 52.16,15.54 51.97,15.72 U2.60
SIM_CLK
  Top 0.305: 17.95,6.12 20.14,3.93 23.11,3.93 24.44,5.26 24.44,8.67 25,9.22 25.16,9.72 U2.32 | 6.96,11.57 13.34,5.2 17.02,5.2 17.95,6.12 | 6.96,11.57 6.84,11.7 | D3.3 18.08,6.4 18.16,6.33 17.95,6.12 | X3.C3 5.94,12.27 6.64,11.57 6.96,11.57
SIM_DATA  (via drill 0.35)
  Top 0.305: U2.31 26.27,10.74 25.37,10.74 23.04,13.07 18.87,13.07 16.78,10.98 D3.5 16.78,14.53 15.6,15.71 13.94,15.71 v13.1,14.87 | v7.63,14.88 7.63,14.84 7.32,14.84 7.32,16.13 X3.C7
  Bottom 0.305: v13.1,14.87 v7.63,14.88
SIM_RST  (via drill 0.35)
  Top 0.305: U2.33 28.02,8.72 28.02,6.88 v27.78,6.64 | v23.64,6.73 23.64,8.59 24.49,9.44 24.49,10.74 23.03,12.21 19.69,12.21 18.08,10.6 D3.4 18.08,9.34 17.59,8.85 16.8,8.85 16.05,8.09 14.86,8.09 14.27,8.69 13.01,8.69 8.5,13.2 8.5,16.22 X3.C2
  Bottom 0.305: v23.64,6.73 23.73,6.64 v27.78,6.64
SIM_VCC  (via drill 0.35)
  Top 0.305: C6.1 18.73,3.75 17.91,4.57 v17.91,4.92 | D3.1 16.78,7.54 16.04,6.8 v15.84,6.8 | U2.30 26.27,11.68 25.37,11.68 21.56,15.48 17.13,15.48 15.06,17.54 v14.18,17.54 | X3.C1 11.02,16.29 | v15.75,9.37 13.83,9.37 11.23,11.97 11.23,16.03 X3.C1 | X3.C1 11.16,16.24 | v12.52,17.75 12.31,17.75 11.05,16.49 11.22,16.49 11.02,16.3 X3.C1
  Bottom 0.305: v17.91,4.92 17.71,4.92 v15.84,6.8 15.75,6.88 v15.75,9.37 | v12.52,17.75 13.98,17.75 v14.18,17.54
STAT
  Top 0.305: IC1.1 56.17,16.46 57.13,16.46 57.26,16.39 R1.1
UC_DTR  (via drill 0.35)
  Top 0.305: IC2.10 38.55,36.68 38.45,36.68 | 38.45,36.68 38.51,36.61 | 38.45,36.68 3.38,36.68 3.26,36.55 v3.26,33.5
  Bottom 0.305: v3.26,33.5 3.26,30.45 1.29,28.49 1.29,24.41 1.44,24.26 U3.MOSI
UC_RI  (via drill 0.35)
  Top 0.305: v8.34,31.98 8.34,36.06 38.05,36.06 IC2.11
  Bottom 0.305: v8.34,31.98 9.35,30.96 | 9.35,30.96 9.35,29.95 | 9.35,30.96 9.47,30.84 U3.GPIO2
UC_RXD  (via drill 0.35)
  Top 0.305: IC2.12 37.55,35.49 32.05,35.49 31.87,35.31 9.35,35.31 9.35,33.5 v10.88,31.98
  Bottom 0.305: v10.88,31.98 11.6,31.98 13.47,30.11 U3.GPIO4
UC_TXD  (via drill 0.35)
  Top 0.305: IC2.13 36.84,34.93 32.46,34.93
  Top 0.308: 32.31,34.44 v32.23,34.36 32.23,34.71 32.46,34.93
  Bottom 0.305: 15.52,29.26 U3.GPIO5 15.36,29.27 15.36,31.27 13.57,31.27 11.73,33.11 11.73,35.42 24.36,35.42 25.66,34.12 25.66,32.29 26.17,31.77 27.59,31.77 28.56,32.74 30.07,32.74 31.69,34.36 v32.23,34.36
V_USB  (via drill 0.35)
  Top 0.305: J8.VBUS 56.2,6.04 56.2,7.35 54.83,7.35 v54.56,7.09 | 54.15,10.23 v53.04,9.12 | IC1.4 54.1,10.29 54.15,10.23 | C2.1 54.67,9.72 54.15,10.23
  Bottom 0.305: v54.56,7.09 53.04,8.61 v53.04,9.12
VIN  (via drill 0.35)  (4 unrouted)
  Top 0.305: U2.55 50.27,10.74 50.27,11.66 U2.56 50.27,11.89 50.27,12.69 U2.57 | 54.2,16.61 IC1.3 | U$1.14 22.61,8.46 22.61,8.92 U$1.15 22.84,8.92 23.07,8.92 23.53,9.37 23.52,10.24 v23.52,10.52 | U$2.7 17.04,28.08 15.76,28.08 14.67,26.99 v14.67,23.42
  Top 0.505: v28.66,10.64 34.24,10.64 v35.77,9.12
  Top 0.508: v47.05,22.33 47.05,22.72 | v49.13,29.19 51.42,29.19 53.5,27.11 v53.7,27.11 | v47.05,22.33 47.05,23.16 v48.3,24.41 | v47.05,22.33 47.05,12.72 U2.57 | v34.54,33.92 36.16,33.92 IC2.14 | v54.74,23.78 54.74,23.16 54.54,22.95 54.54,17.96 54.12,17.96 54.1,17.93 IC1.3 53.99,16.61 | v39.83,13.18 40.85,13.18 v42.88,11.15
  Top 0.61: U$2.7 24.37,28.2 25.61,29.44 v27.64,29.44 | U$2.16 10.73,19.51 v9.02,19.51
  Bottom 0.305: 21.92,33.15 JP6.1 | 4.84,14.81 6.04,14.81 9.9,18.67 | 9.9,18.67 | R4.2 29.55,14.31 29.56,14.3 30.03,14.3 | 30.03,14.3 30.14,14.3 R3.2 | 45.8,15.25 45.55,15 C11.1 | v28.66,10.64 30.03,12.02 30.03,14.3 | 9.9,18.67 9.86,18.67 v9.02,19.51
  Bottom 0.505: 43.19,11.15 v42.88,11.15
  Bottom 0.508: 58.95,10.89 48.04,10.89 C8.1 47.94,11.57 48.8,12.43 50.43,12.43 | LED3.A 61.44,8.39 61.4,8.39 | C10.1 47.07,16.53 45.8,15.25 | C5.1 50.42,31.14 C1.1 47.2,31.6 C9.1 42.41,29.44 v27.64,29.44 | J6.2 56.63,27.52 56.83,27.32 56.74,27.11 v53.7,27.11 54.74,26.07 v54.74,23.78 | v47.05,22.33 47.05,19.41 | C5.1 50.47,30.75 49.13,29.41 v49.13,29.19 | v48.3,24.41 48.3,28.6 50.47,30.77 C5.1 | R6.2 25.63,31.18 23.46,33.34 JP6.1
  Bottom 0.51: 58.95,10.89 61.44,8.39
  Bottom 0.605: C12.1 43.19,8.43 43.19,11.15
  Bottom 0.61: v34.54,33.92 34.54,33.71 32.81,31.98 30.18,31.98 v27.64,29.44 27.05,30.03 R6.2 | v14.67,23.42 14.67,23.24 14.69,23.23 14.69,22.31 12.62,20.29 9.81,20.29 v9.02,19.51 | v23.52,10.52 23.8,10.49 24.26,10.95 28.66,10.95 v28.66,10.64
  Bottom 0.813: C12.1 44.66,9.24 47.96,9.24 47.96,10.76 C8.1 | v35.77,9.12 v39.83,13.18